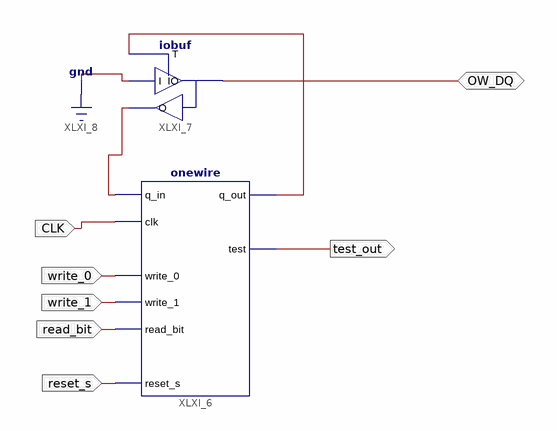
[diagram p0: schematic sheet 1]
// Xilinx ISE schematic a1.sch (spartan3e) as structural Verilog: 2 symbols, 7 ports
module a1 (
  input  CLK,
  input  reset_s,
  input  write_0,
  input  write_1,
  input  read_bit,
  inout  OW_DQ,
  output test_out
);

  wire XLXN_27, XLXN_28;

  onewire XLXI_6 (
    .q_in(XLXN_27), .clk(CLK), .write_0(write_0), .write_1(write_1), .read_bit(read_bit), .reset_s(reset_s),
    .q_out(XLXN_28), .test(test_out));
  iobuf XLXI_7 (.I(1'b0), .IO(OW_DQ), .O(XLXN_27), .T(XLXN_28));
endmodule
